# Altium schematic sheet QCopterRC_LED_Sch.SchDoc
size A4
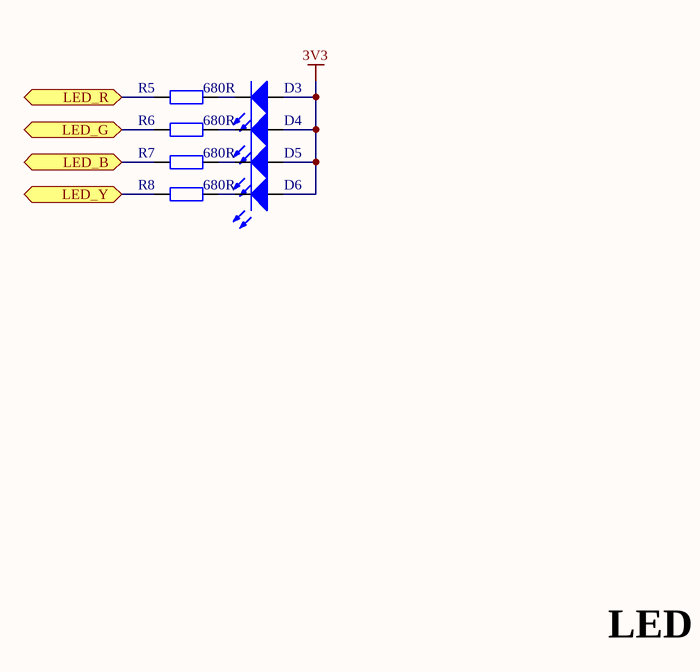
[diagram p0: QCopterRC_LED_Sch.SchDoc]

## Parts
D3  LED_0603_RED  [LED_0603_RED]  (value not drawn)
D4  LED_0603_GREEN  [LED_0603_GREEN]  (value not drawn)
D5  LED_0603_BLUE  [LED_0603_BLUE]  (value not drawn)
D6  LED_0603_YELLOW  [LED_0603_YELLOW]  (value not drawn)
R5  value 680R  [RES_0603]  (hidden comment: Res_0603)
R6  value 680R  [RES_0603]  (hidden comment: Res_0603)
R7  value 680R  [RES_0603]  (hidden comment: Res_0603)
R8  value 680R  [RES_0603]  (hidden comment: Res_0603)

## Ports
LED_B, LED_G, LED_R, LED_Y

## Nets
3V3: D3.1(A) D4.1(A) D5.1(A) D6.1(A)
LED_B: R7.1 ; port LED_B
LED_G: R6.1 ; port LED_G
LED_R: R5.1 ; port LED_R
LED_Y: R8.1 ; port LED_Y
NetD3_2: D3.2(K) R5.2
NetD4_2: D4.2(K) R6.2
NetD5_2: D5.2(K) R7.2
NetD6_2: D6.2(K) R8.2

## Notes on the sheet
- LED

## Library data of the parts
D3 = LED_0603_RED: LED
D4 = LED_0603_GREEN: LED
D5 = LED_0603_BLUE: LED
D6 = LED_0603_YELLOW: LED
R5-R8 = Res_0603: Resistor